# EAGLE schematic EEG_cap_v1 (EAGLE 9.6.2)

## Sheet 1 of 4
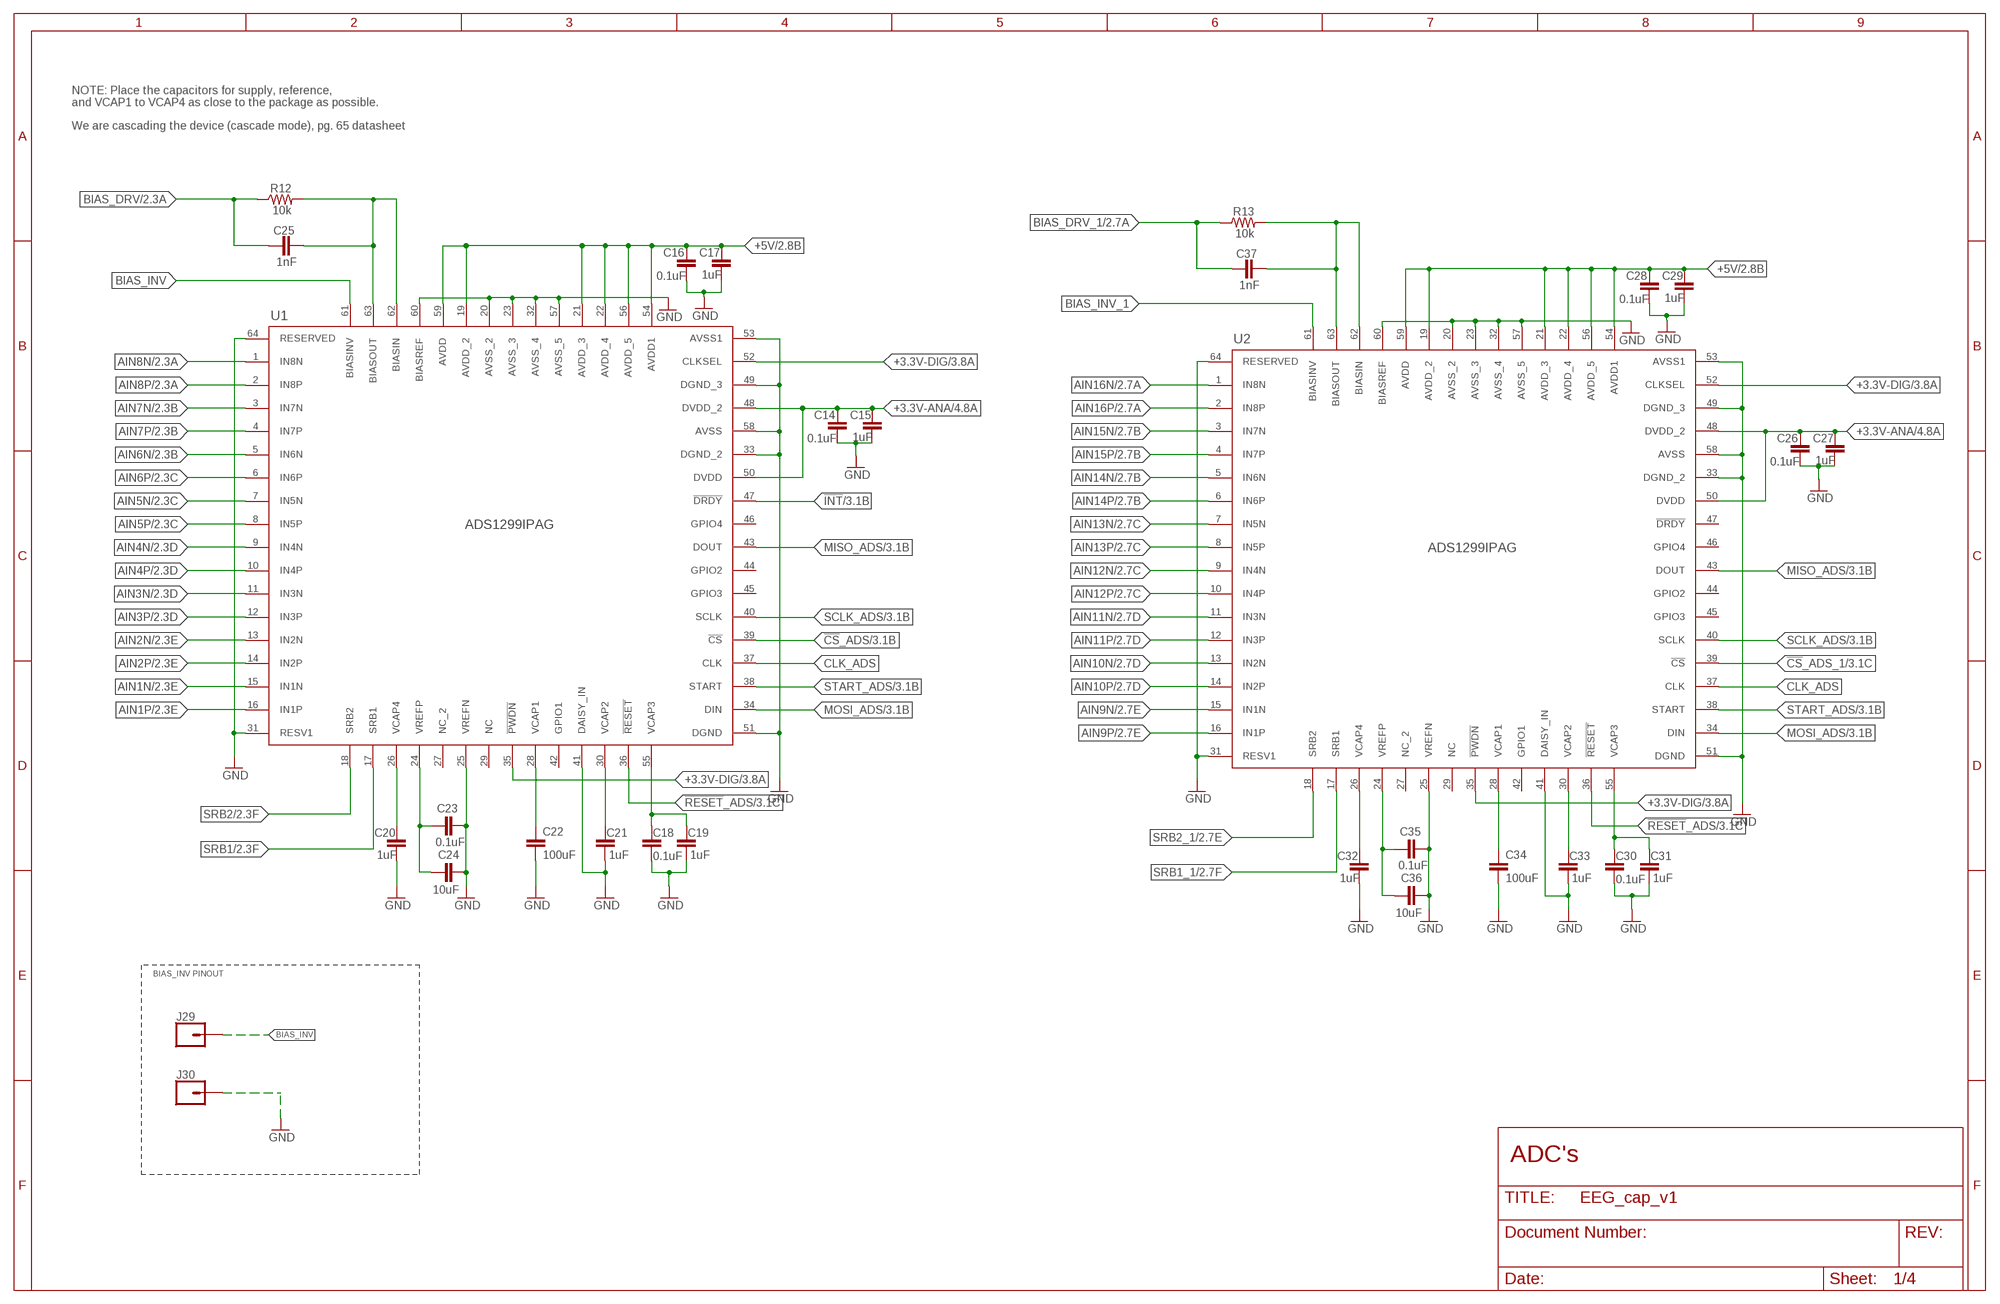
[diagram p0: schematic, sheet 1]

### Parts
C14  0.1uF  C-EUC0603  [C0603]
C15  1uF  C-EUC0603  [C0603]
C16  0.1uF  C-EUC0603  [C0603]
C17  1uF  C-EUC0603  [C0603]
C18  0.1uF  C-EUC0603  [C0603]
C19  1uF  C-EUC0603  [C0603]
C20  1uF  C-EUC0603  [C0603]
C21  1uF  C-EUC0603  [C0603]
C22  100uF  C-EUC1210  [C1210]
C23  0.1uF  C-EUC0603  [C0603]
C24  10uF  C-EUC0805  [C0805]
C25  1nF  C-EUC0603  [C0603]
C26  0.1uF  C-EUC0603  [C0603]
C27  1uF  C-EUC0603  [C0603]
C28  0.1uF  C-EUC0603  [C0603]
C29  1uF  C-EUC0603  [C0603]
C30  0.1uF  C-EUC0603  [C0603]
C31  1uF  C-EUC0603  [C0603]
C32  1uF  C-EUC0603  [C0603]
C33  1uF  C-EUC0603  [C0603]
C34  100uF  C-EUC1210  [C1210]
C35  0.1uF  C-EUC0603  [C0603]
C36  10uF  C-EUC0805  [C0805]
C37  1nF  C-EUC0603  [C0603]
J29  CONN_01  [1X01]
J30  CONN_01  [1X01]
R12  10k  R-US_R0805  [R0805]
R13  10k  R-US_R0805  [R0805]
U1  ADS1299IPAG  [PAG64_TEX]
U2  ADS1299IPAG  [PAG64_TEX]

### Nets
!CS!_ADS: U1.39(!CS) ; also sheet 3
!CS!_ADS_1: U2.39(!CS) ; also sheet 3
!INT!: U1.47(!DRDY) ; also sheet 3
!RESET!_ADS: U1.36(!RESET) U2.36(!RESET) ; also sheet 3
+3.3V-ANA: C14.1 C15.1 C26.1 C27.1 U1.48(DVDD_2) U1.50(DVDD) U2.48(DVDD_2) U2.50(DVDD) ; also sheet 4
+3.3V-DIG: U1.35(!PWDN) U1.52(CLKSEL) U2.35(!PWDN) U2.52(CLKSEL) ; also sheet 3,4
+5V: C16.1 C17.1 C28.1 C29.1 U1.19(AVDD_2) U1.21(AVDD_3) U1.22(AVDD_4) U1.54(AVDD1) U1.56(AVDD_5) U1.59(AVDD) U2.19(AVDD_2) U2.21(AVDD_3) U2.22(AVDD_4) U2.54(AVDD1) U2.56(AVDD_5) U2.59(AVDD) ; also sheet 2,3,4
AIN1N: U1.15(IN1N) ; also sheet 2
AIN1P: U1.16(IN1P) ; also sheet 2
AIN2N: U1.13(IN2N) ; also sheet 2
AIN2P: U1.14(IN2P) ; also sheet 2
AIN3N: U1.11(IN3N) ; also sheet 2
AIN3P: U1.12(IN3P) ; also sheet 2
AIN4N: U1.9(IN4N) ; also sheet 2
AIN4P: U1.10(IN4P) ; also sheet 2
AIN5N: U1.7(IN5N) ; also sheet 2
AIN5P: U1.8(IN5P) ; also sheet 2
AIN6N: U1.5(IN6N) ; also sheet 2
AIN6P: U1.6(IN6P) ; also sheet 2
AIN7N: U1.3(IN7N) ; also sheet 2
AIN7P: U1.4(IN7P) ; also sheet 2
AIN8N: U1.1(IN8N) ; also sheet 2
AIN8P: U1.2(IN8P) ; also sheet 2
AIN9N: U2.15(IN1N) ; also sheet 2
AIN9P: U2.16(IN1P) ; also sheet 2
AIN10N: U2.13(IN2N) ; also sheet 2
AIN10P: U2.14(IN2P) ; also sheet 2
AIN11N: U2.11(IN3N) ; also sheet 2
AIN11P: U2.12(IN3P) ; also sheet 2
AIN12N: U2.9(IN4N) ; also sheet 2
AIN12P: U2.10(IN4P) ; also sheet 2
AIN13N: U2.7(IN5N) ; also sheet 2
AIN13P: U2.8(IN5P) ; also sheet 2
AIN14N: U2.5(IN6N) ; also sheet 2
AIN14P: U2.6(IN6P) ; also sheet 2
AIN15N: U2.3(IN7N) ; also sheet 2
AIN15P: U2.4(IN7P) ; also sheet 2
AIN16N: U2.1(IN8N) ; also sheet 2
AIN16P: U2.2(IN8P) ; also sheet 2
BIAS: C25.2 R12.2 U1.62(BIASIN) U1.63(BIASOUT) ; also sheet 2
BIAS1: C37.2 R13.2 U2.62(BIASIN) U2.63(BIASOUT)
BIAS_DRV: C25.1 R12.1 ; also sheet 2
BIAS_DRV_1: C37.1 R13.1 ; also sheet 2
BIAS_INV: J29.1 U1.61(BIASINV)
BIAS_INV_1: U2.61(BIASINV)
CLK_ADS: U1.37(CLK) U2.37(CLK)
GND: C14.2 C15.2 C16.2 C17.2 C18.2 C19.2 C20.2 C21.2 C22.2 C23.2 C24.2 C26.2 C27.2 C28.2 C29.2 C30.2 C31.2 C32.2 C33.2 C34.2 C35.2 C36.2 J30.1 U1.20(AVSS_2) U1.23(AVSS_3) U1.25(VREFN) U1.31(RESV1) U1.32(AVSS_4) U1.33(DGND_2) U1.41(DAISY_IN) U1.49(DGND_3) U1.51(DGND) U1.53(AVSS1) U1.57(AVSS_5) U1.58(AVSS) U1.60(BIASREF) U1.64(RESERVED) U2.20(AVSS_2) U2.23(AVSS_3) U2.25(VREFN) U2.31(RESV1) U2.32(AVSS_4) U2.33(DGND_2) U2.41(DAISY_IN) U2.49(DGND_3) U2.51(DGND) U2.53(AVSS1) U2.57(AVSS_5) U2.58(AVSS) U2.60(BIASREF) U2.64(RESERVED) ; also sheet 2,3,4
MISO_ADS: U1.43(DOUT) U2.43(DOUT) ; also sheet 3
MOSI_ADS: U1.34(DIN) U2.34(DIN) ; also sheet 3
SCLK_ADS: U1.40(SCLK) U2.40(SCLK) ; also sheet 3
SRB1: U1.17(SRB1) ; also sheet 2
SRB1_1: U2.17(SRB1) ; also sheet 2
SRB2: U1.18(SRB2) ; also sheet 2
SRB2_1: U2.18(SRB2) ; also sheet 2
START_ADS: U1.38(START) U2.38(START) ; also sheet 3
VCAP1: C22.1 U1.28(VCAP1)
VCAP1_1: C34.1 U2.28(VCAP1)
VCAP2: C21.1 U1.30(VCAP2)
VCAP2_1: C33.1 U2.30(VCAP2)
VCAP3: C18.1 C19.1 U1.55(VCAP3)
VCAP3_1: C30.1 C31.1 U2.55(VCAP3)
VCAP4: C20.1 U1.26(VCAP4)
VCAP6: C32.1 U2.26(VCAP4)
VREFP: C23.1 C24.1 U1.24(VREFP)
VREFP_1: C35.1 C36.1 U2.24(VREFP)
Unconnected: U1.27(NC_2) U1.29(NC) U1.42(GPIO1) U1.44(GPIO2) U1.45(GPIO3) U1.46(GPIO4) U2.27(NC_2) U2.29(NC) U2.42(GPIO1) U2.44(GPIO2) U2.45(GPIO3) U2.46(GPIO4) U2.47(!DRDY)

### Notes on the sheet
- NOTE: Place the capacitors for supply, reference,
  and VCAP1 to VCAP4 as close to the package as possible.
- We are cascading the device (cascade mode), pg. 65 datasheet
- BIAS_INV PINOUT
- ADC's

## Sheet 2 of 4
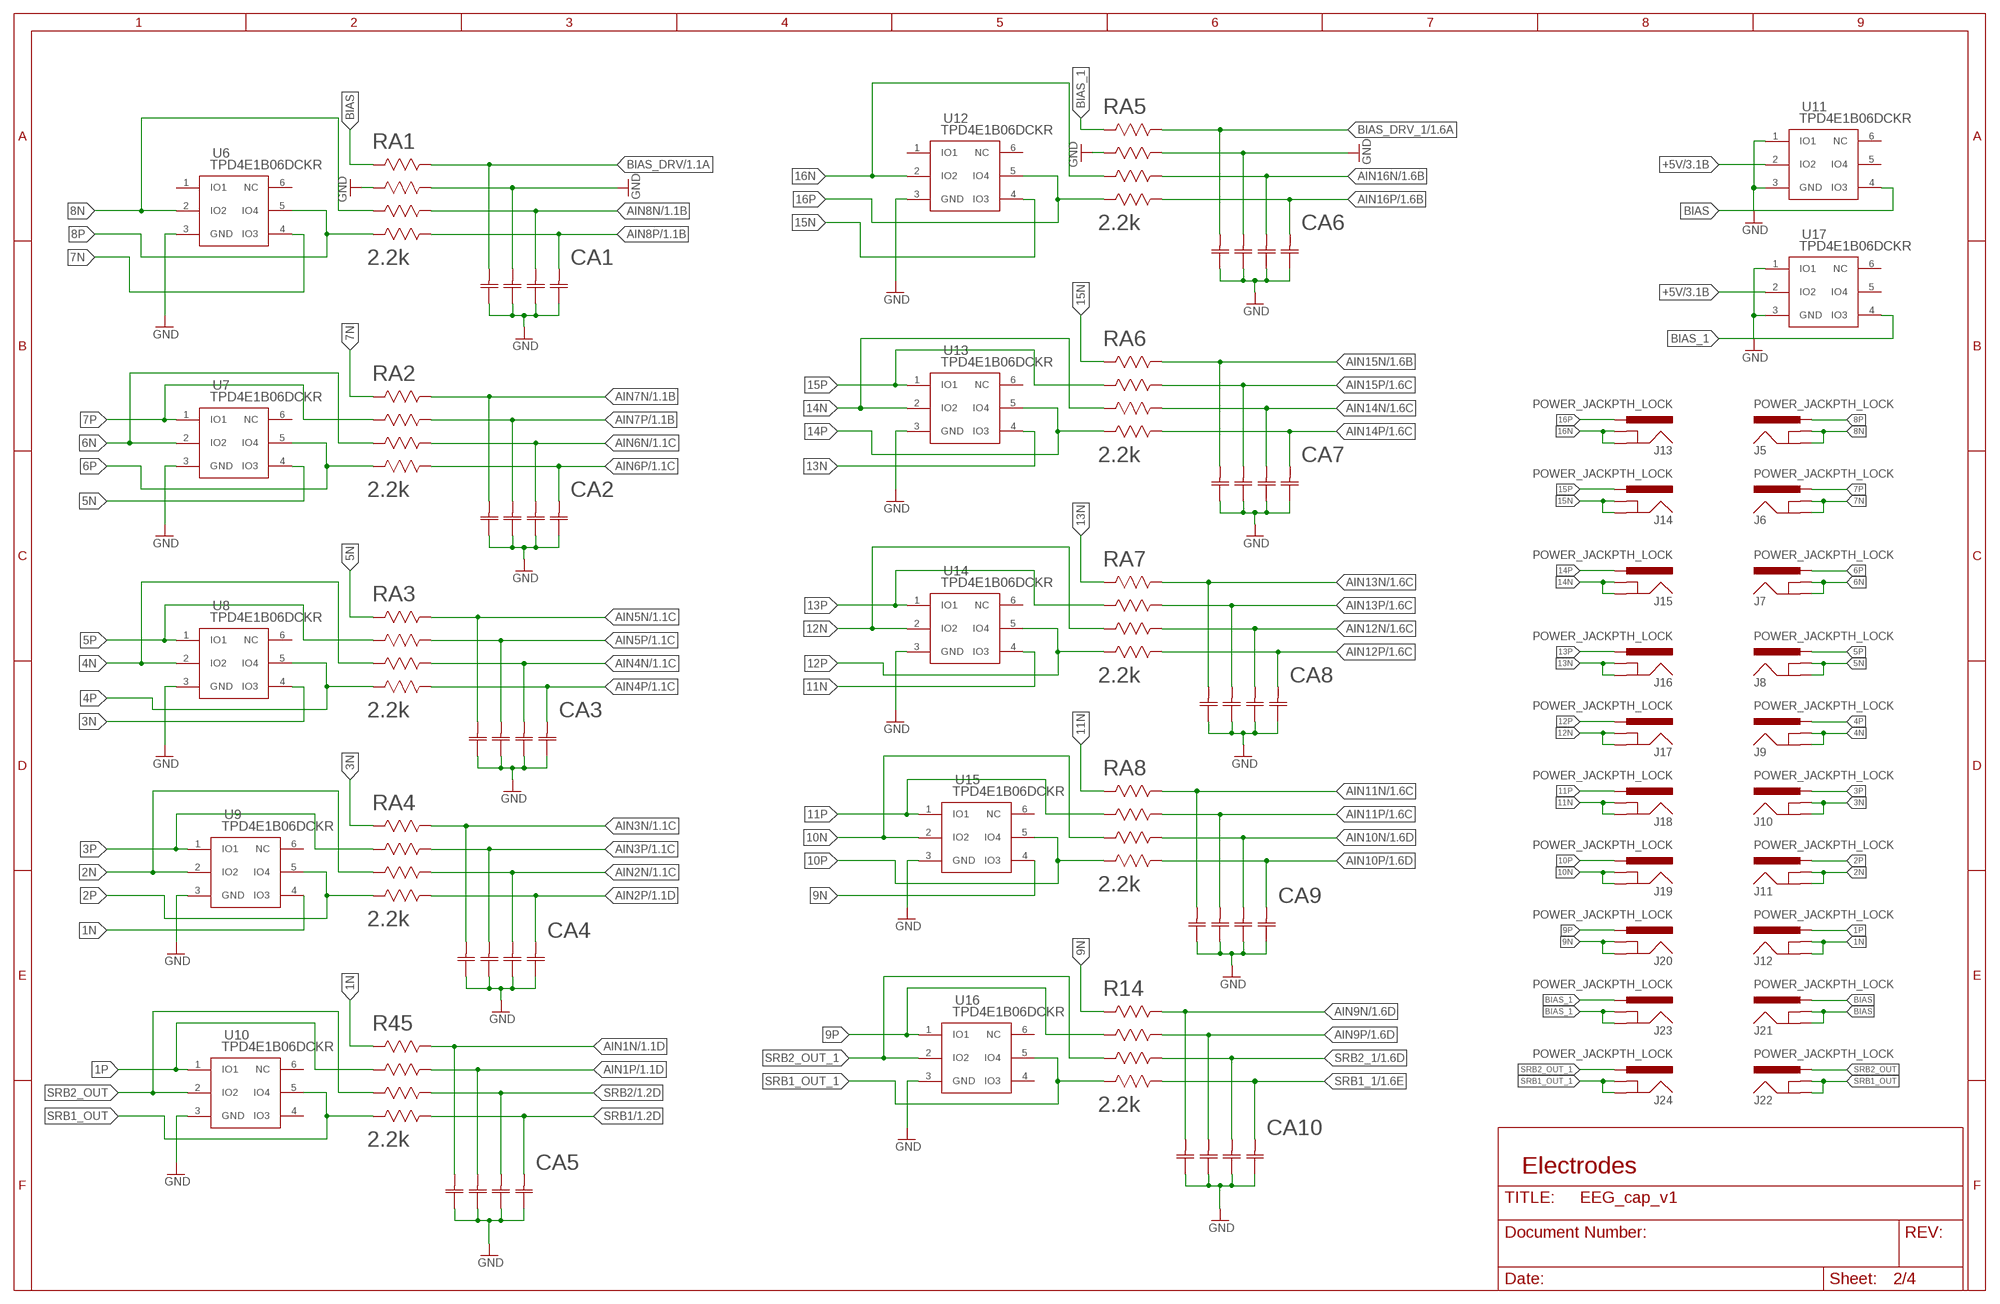
[diagram p1: schematic, sheet 2]

### Parts
CA1  CAP_ARRAY  [CAP_CA0612_3P2X1P6_YAG]
CA2  CAP_ARRAY  [CAP_CA0612_3P2X1P6_YAG]
CA3  CAP_ARRAY  [CAP_CA0612_3P2X1P6_YAG]
CA4  CAP_ARRAY  [CAP_CA0612_3P2X1P6_YAG]
CA5  CAP_ARRAY  [CAP_CA0612_3P2X1P6_YAG]
CA6  CAP_ARRAY  [CAP_CA0612_3P2X1P6_YAG]
CA7  CAP_ARRAY  [CAP_CA0612_3P2X1P6_YAG]
CA8  CAP_ARRAY  [CAP_CA0612_3P2X1P6_YAG]
CA9  CAP_ARRAY  [CAP_CA0612_3P2X1P6_YAG]
CA10  CAP_ARRAY  [CAP_CA0612_3P2X1P6_YAG]
J5  POWER_JACKPTH_LOCK  [POWER_JACK_PTH_LOCK]
J6  POWER_JACKPTH_LOCK  [POWER_JACK_PTH_LOCK]
J7  POWER_JACKPTH_LOCK  [POWER_JACK_PTH_LOCK]
J8  POWER_JACKPTH_LOCK  [POWER_JACK_PTH_LOCK]
J9  POWER_JACKPTH_LOCK  [POWER_JACK_PTH_LOCK]
J10  POWER_JACKPTH_LOCK  [POWER_JACK_PTH_LOCK]
J11  POWER_JACKPTH_LOCK  [POWER_JACK_PTH_LOCK]
J12  POWER_JACKPTH_LOCK  [POWER_JACK_PTH_LOCK]
J13  POWER_JACKPTH_LOCK  [POWER_JACK_PTH_LOCK]
J14  POWER_JACKPTH_LOCK  [POWER_JACK_PTH_LOCK]
J15  POWER_JACKPTH_LOCK  [POWER_JACK_PTH_LOCK]
J16  POWER_JACKPTH_LOCK  [POWER_JACK_PTH_LOCK]
J17  POWER_JACKPTH_LOCK  [POWER_JACK_PTH_LOCK]
J18  POWER_JACKPTH_LOCK  [POWER_JACK_PTH_LOCK]
J19  POWER_JACKPTH_LOCK  [POWER_JACK_PTH_LOCK]
J20  POWER_JACKPTH_LOCK  [POWER_JACK_PTH_LOCK]
J21  POWER_JACKPTH_LOCK  [POWER_JACK_PTH_LOCK]
J22  POWER_JACKPTH_LOCK  [POWER_JACK_PTH_LOCK]
J23  POWER_JACKPTH_LOCK  [POWER_JACK_PTH_LOCK]
J24  POWER_JACKPTH_LOCK  [POWER_JACK_PTH_LOCK]
R14  2.2k  CAT16-220J4LF  [BO_CAT16]
R45  2.2k  CAT16-220J4LF  [BO_CAT16]
RA1  2.2k  CAT16-220J4LF  [BO_CAT16]
RA2  2.2k  CAT16-220J4LF  [BO_CAT16]
RA3  2.2k  CAT16-220J4LF  [BO_CAT16]
RA4  2.2k  CAT16-220J4LF  [BO_CAT16]
RA5  2.2k  CAT16-220J4LF  [BO_CAT16]
RA6  2.2k  CAT16-220J4LF  [BO_CAT16]
RA7  2.2k  CAT16-220J4LF  [BO_CAT16]
RA8  2.2k  CAT16-220J4LF  [BO_CAT16]
U6  TPD4E1B06DCKR  [DCK6_TEX]
U7  TPD4E1B06DCKR  [DCK6_TEX]
U8  TPD4E1B06DCKR  [DCK6_TEX]
U9  TPD4E1B06DCKR  [DCK6_TEX]
U10  TPD4E1B06DCKR  [DCK6_TEX]
U11  TPD4E1B06DCKR  [DCK6_TEX]
U12  TPD4E1B06DCKR  [DCK6_TEX]
U13  TPD4E1B06DCKR  [DCK6_TEX]
U14  TPD4E1B06DCKR  [DCK6_TEX]
U15  TPD4E1B06DCKR  [DCK6_TEX]
U16  TPD4E1B06DCKR  [DCK6_TEX]
U17  TPD4E1B06DCKR  [DCK6_TEX]

### Nets
1N: J12.GND J12.GNDBREAK R45.1 U9.4(IO3)
1P: J12.PWR R45.2 U10.1(IO1)
2N: J11.GND J11.GNDBREAK RA4.3 U9.2(IO2)
2P: J11.PWR RA4.4 U9.5(IO4)
3N: J10.GND J10.GNDBREAK RA4.1 U8.4(IO3)
3P: J10.PWR RA4.2 U9.1(IO1)
4N: J9.GND J9.GNDBREAK RA3.3 U8.2(IO2)
4P: J9.PWR RA3.4 U8.5(IO4)
5N: J8.GND J8.GNDBREAK RA3.1 U7.4(IO3)
5P: J8.PWR RA3.2 U8.1(IO1)
6N: J7.GND J7.GNDBREAK RA2.3 U7.2(IO2)
6P: J7.PWR RA2.4 U7.5(IO4)
7N: J6.GND J6.GNDBREAK RA2.1 U6.4(IO3)
7P: J6.PWR RA2.2 U7.1(IO1)
8N: J5.GND J5.GNDBREAK RA1.3 U6.2(IO2)
8P: J5.PWR RA1.4 U6.5(IO4)
9N: J20.GND J20.GNDBREAK R14.1 U15.4(IO3)
9P: J20.PWR R14.2 U16.1(IO1)
10N: J19.GND J19.GNDBREAK RA8.3 U15.2(IO2)
10P: J19.PWR RA8.4 U15.5(IO4)
11N: J18.GND J18.GNDBREAK RA8.1 U14.4(IO3)
11P: J18.PWR RA8.2 U15.1(IO1)
12N: J17.GND J17.GNDBREAK RA7.3 U14.2(IO2)
12P: J17.PWR RA7.4 U14.5(IO4)
13N: J16.GND J16.GNDBREAK RA7.1 U13.4(IO3)
13P: J16.PWR RA7.2 U14.1(IO1)
14N: J15.GND J15.GNDBREAK RA6.3 U13.2(IO2)
14P: J15.PWR RA6.4 U13.5(IO4)
15N: J14.GND J14.GNDBREAK RA6.1 U12.4(IO3)
15P: J14.PWR RA6.2 U13.1(IO1)
16N: J13.GND J13.GNDBREAK RA5.3 U12.2(IO2)
16P: J13.PWR RA5.4 U12.5(IO4)
+5V: U11.2(IO2) U17.2(IO2) ; also sheet 1,3,4
AIN1N: CA5.8 R45.8 ; also sheet 1
AIN1P: CA5.7 R45.7 ; also sheet 1
AIN2N: CA4.6 RA4.6 ; also sheet 1
AIN2P: CA4.5 RA4.5 ; also sheet 1
AIN3N: CA4.8 RA4.8 ; also sheet 1
AIN3P: CA4.7 RA4.7 ; also sheet 1
AIN4N: CA3.6 RA3.6 ; also sheet 1
AIN4P: CA3.5 RA3.5 ; also sheet 1
AIN5N: CA3.8 RA3.8 ; also sheet 1
AIN5P: CA3.7 RA3.7 ; also sheet 1
AIN6N: CA2.6 RA2.6 ; also sheet 1
AIN6P: CA2.5 RA2.5 ; also sheet 1
AIN7N: CA2.8 RA2.8 ; also sheet 1
AIN7P: CA2.7 RA2.7 ; also sheet 1
AIN8N: CA1.6 RA1.6 ; also sheet 1
AIN8P: CA1.5 RA1.5 ; also sheet 1
AIN9N: CA10.8 R14.8 ; also sheet 1
AIN9P: CA10.7 R14.7 ; also sheet 1
AIN10N: CA9.6 RA8.6 ; also sheet 1
AIN10P: CA9.5 RA8.5 ; also sheet 1
AIN11N: CA9.8 RA8.8 ; also sheet 1
AIN11P: CA9.7 RA8.7 ; also sheet 1
AIN12N: CA8.6 RA7.6 ; also sheet 1
AIN12P: CA8.5 RA7.5 ; also sheet 1
AIN13N: CA8.8 RA7.8 ; also sheet 1
AIN13P: CA8.7 RA7.7 ; also sheet 1
AIN14N: CA7.6 RA6.6 ; also sheet 1
AIN14P: CA7.5 RA6.5 ; also sheet 1
AIN15N: CA7.8 RA6.8 ; also sheet 1
AIN15P: CA7.7 RA6.7 ; also sheet 1
AIN16N: CA6.6 RA5.6 ; also sheet 1
AIN16P: CA6.5 RA5.5 ; also sheet 1
BIAS: J21.GND J21.GNDBREAK J21.PWR RA1.1 U11.4(IO3) ; also sheet 1
BIAS_1: J23.GND J23.GNDBREAK J23.PWR RA5.1 U17.4(IO3)
BIAS_DRV: CA1.8 RA1.8 ; also sheet 1
BIAS_DRV_1: CA6.8 RA5.8 ; also sheet 1
GND: CA1.1 CA1.2 CA1.3 CA1.4 CA1.7 CA2.1 CA2.2 CA2.3 CA2.4 CA3.1 CA3.2 CA3.3 CA3.4 CA4.1 CA4.2 CA4.3 CA4.4 CA5.1 CA5.2 CA5.3 CA5.4 CA6.1 CA6.2 CA6.3 CA6.4 CA6.7 CA7.1 CA7.2 CA7.3 CA7.4 CA8.1 CA8.2 CA8.3 CA8.4 CA9.1 CA9.2 CA9.3 CA9.4 CA10.1 CA10.2 CA10.3 CA10.4 RA1.2 RA1.7 RA5.2 RA5.7 U6.3(GND) U7.3(GND) U8.3(GND) U9.3(GND) U10.3(GND) U11.1(IO1) U11.3(GND) U12.3(GND) U13.3(GND) U14.3(GND) U15.3(GND) U16.3(GND) U17.1(IO1) U17.3(GND) ; also sheet 1,3,4
SRB1: CA5.5 R45.5 ; also sheet 1
SRB1_1: CA10.5 R14.5 ; also sheet 1
SRB1_OUT: J22.GND J22.GNDBREAK R45.4 U10.5(IO4)
SRB1_OUT_1: J24.GND J24.GNDBREAK R14.4 U16.5(IO4)
SRB2: CA5.6 R45.6 ; also sheet 1
SRB2_1: CA10.6 R14.6 ; also sheet 1
SRB2_OUT: J22.PWR R45.3 U10.2(IO2)
SRB2_OUT_1: J24.PWR R14.3 U16.2(IO2)
Unconnected: U6.1(IO1) U6.6(NC) U7.6(NC) U8.6(NC) U9.6(NC) U10.4(IO3) U10.6(NC) U11.5(IO4) U11.6(NC) U12.1(IO1) U12.6(NC) U13.6(NC) U14.6(NC) U15.6(NC) U16.4(IO3) U16.6(NC) U17.5(IO4) U17.6(NC)

### Notes on the sheet
- Electrodes

## Sheet 3 of 4
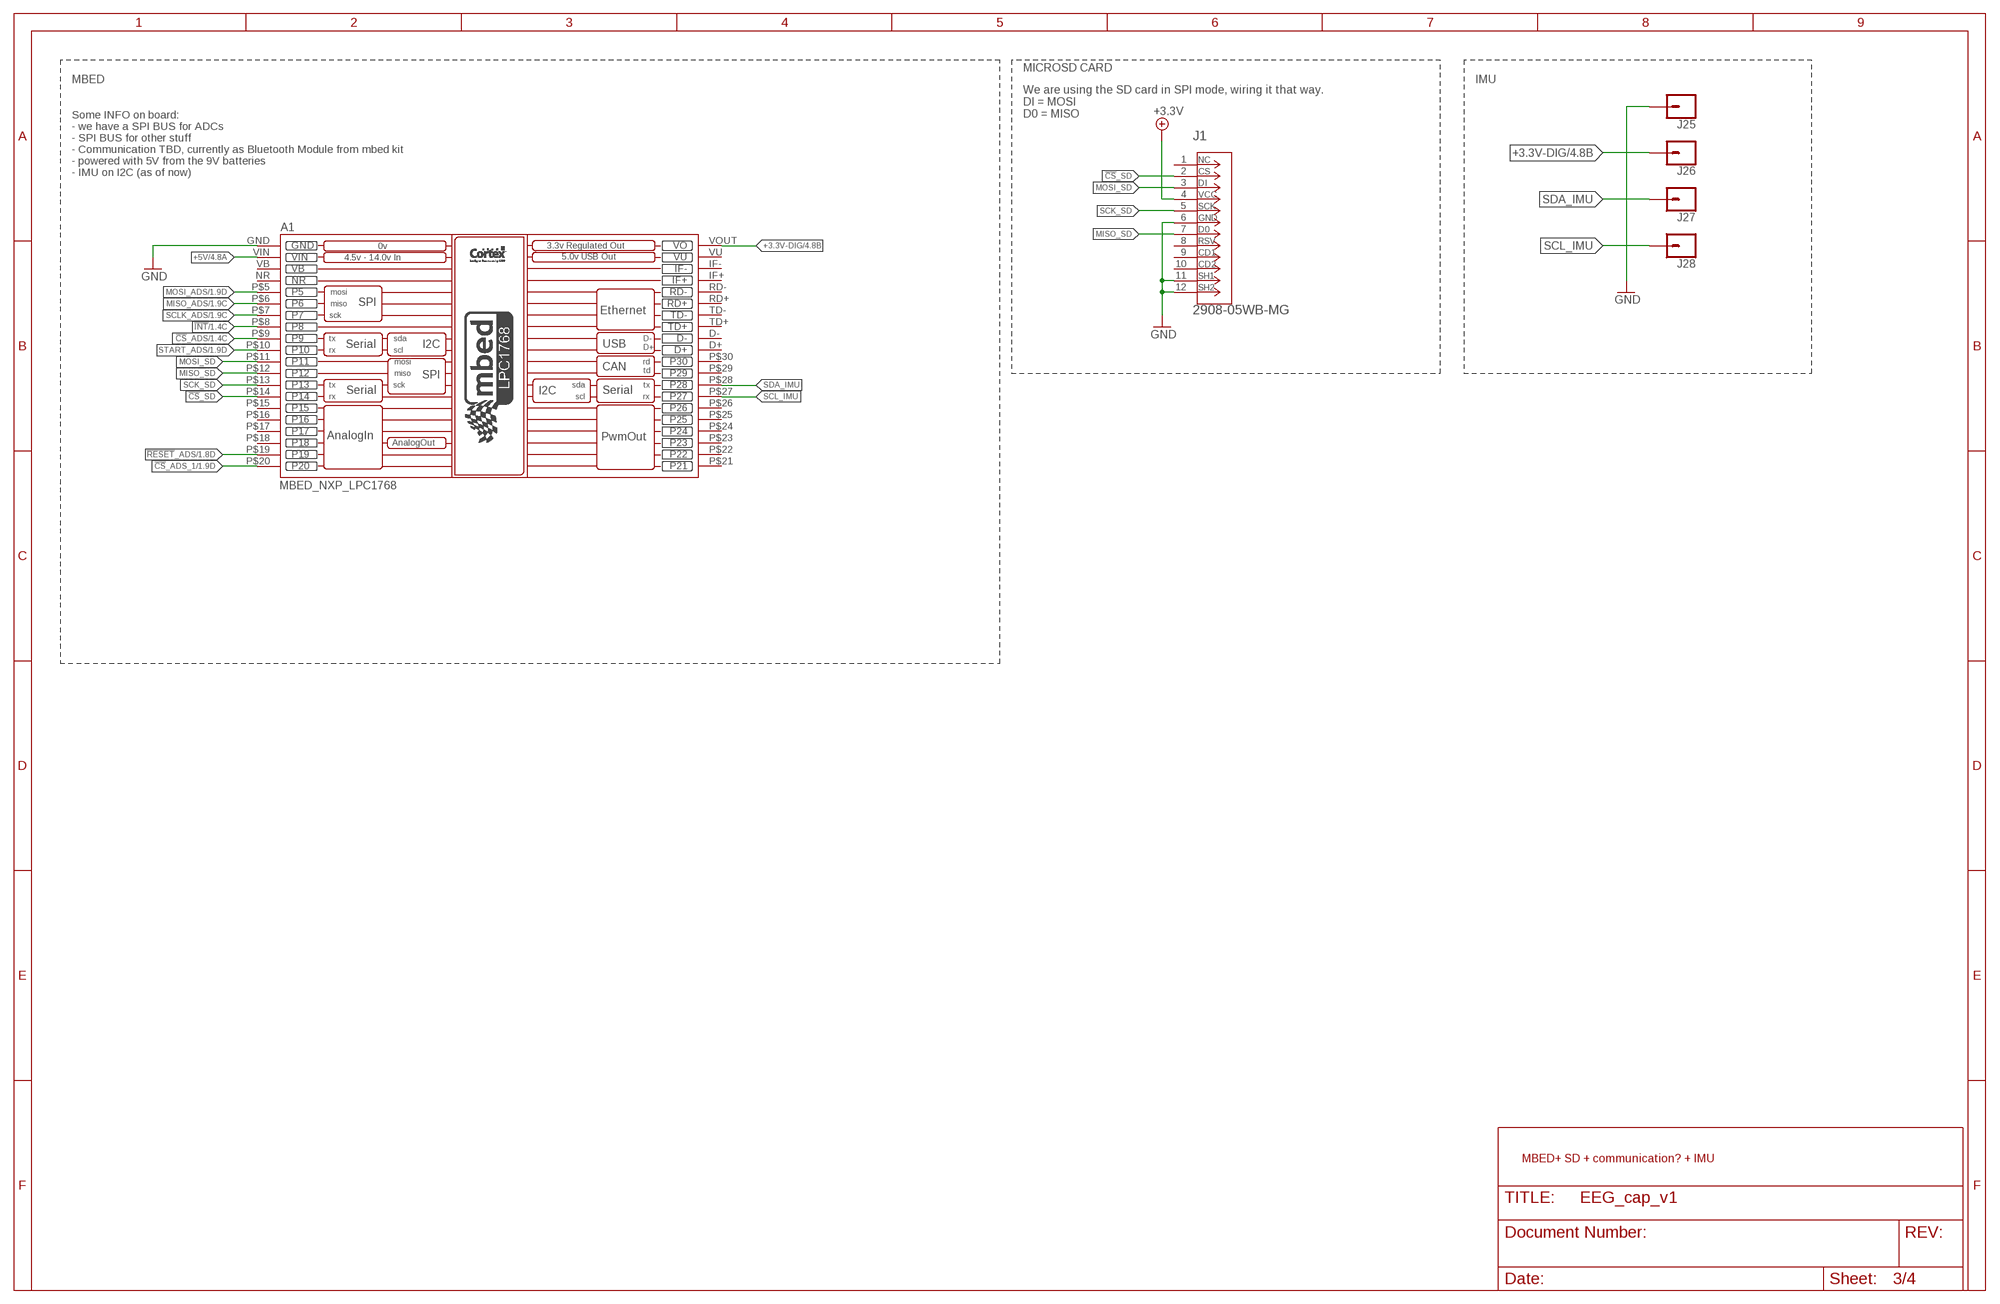
[diagram p2: schematic, sheet 3]

### Parts
A1  MBED_NXP_LPC1768  [MBED_LPC1768]
J1  2908-05WB-MG  [CONN_3M_2900]
J25  CONN_01  [1X01]
J26  CONN_01  [1X01]
J27  CONN_01  [1X01]
J28  CONN_01  [1X01]

### Nets
!CS!_ADS: A1.P$9(P9) ; also sheet 1
!CS!_ADS_1: A1.P$20(P20) ; also sheet 1
!CS!_SD: A1.P$14(P14) J1.2
!INT!: A1.P$8(P8) ; also sheet 1
!RESET!_ADS: A1.P$19(P19) ; also sheet 1
+3.3V: J1.4
+3.3V-DIG: A1.VOUT(VO) J26.1 ; also sheet 1,4
+5V: A1.VIN ; also sheet 1,2,4
GND: A1.GND J1.6 J1.11 J1.12 J25.1 ; also sheet 1,2,4
MISO_ADS: A1.P$6(P6) ; also sheet 1
MISO_SD: A1.P$12(P12) J1.7
MOSI_ADS: A1.P$5(P5) ; also sheet 1
MOSI_SD: A1.P$11(P11) J1.3
SCK_SD: A1.P$13(P13) J1.5
SCL_IMU: A1.P$27(P27) J28.1
SCLK_ADS: A1.P$7(P7) ; also sheet 1
SDA_IMU: A1.P$28(P28) J27.1
START_ADS: A1.P$10(P10) ; also sheet 1
Unconnected: A1.D+ A1.D- A1.IF+ A1.IF- A1.NR A1.P$15(P15) A1.P$16(P16) A1.P$17(P17) A1.P$18(P18) A1.P$21(P21) A1.P$22(P22) A1.P$23(P23) A1.P$24(P24) A1.P$25(P25) A1.P$26(P26) A1.P$29(P29) A1.P$30(P30) A1.RD+ A1.RD- A1.TD+ A1.TD- A1.VB A1.VU J1.1 J1.8 J1.9 J1.10

### Notes on the sheet
- MICROSD CARD
- MBED | IMU
- We are using the SD card in SPI mode, wiring it that way. 
  DI = MOSI
  D0 = MISO
- Some INFO on board: 
  - we have a SPI BUS for ADCs 
  - SPI BUS for other stuff 
  - Communication TBD, currently as Bluetooth Module from mbed kit 
  - powered with 5V from the 9V batteries 
  - IMU on I2C (as of now)
- MBED+ SD + communication? + IMU

## Sheet 4 of 4
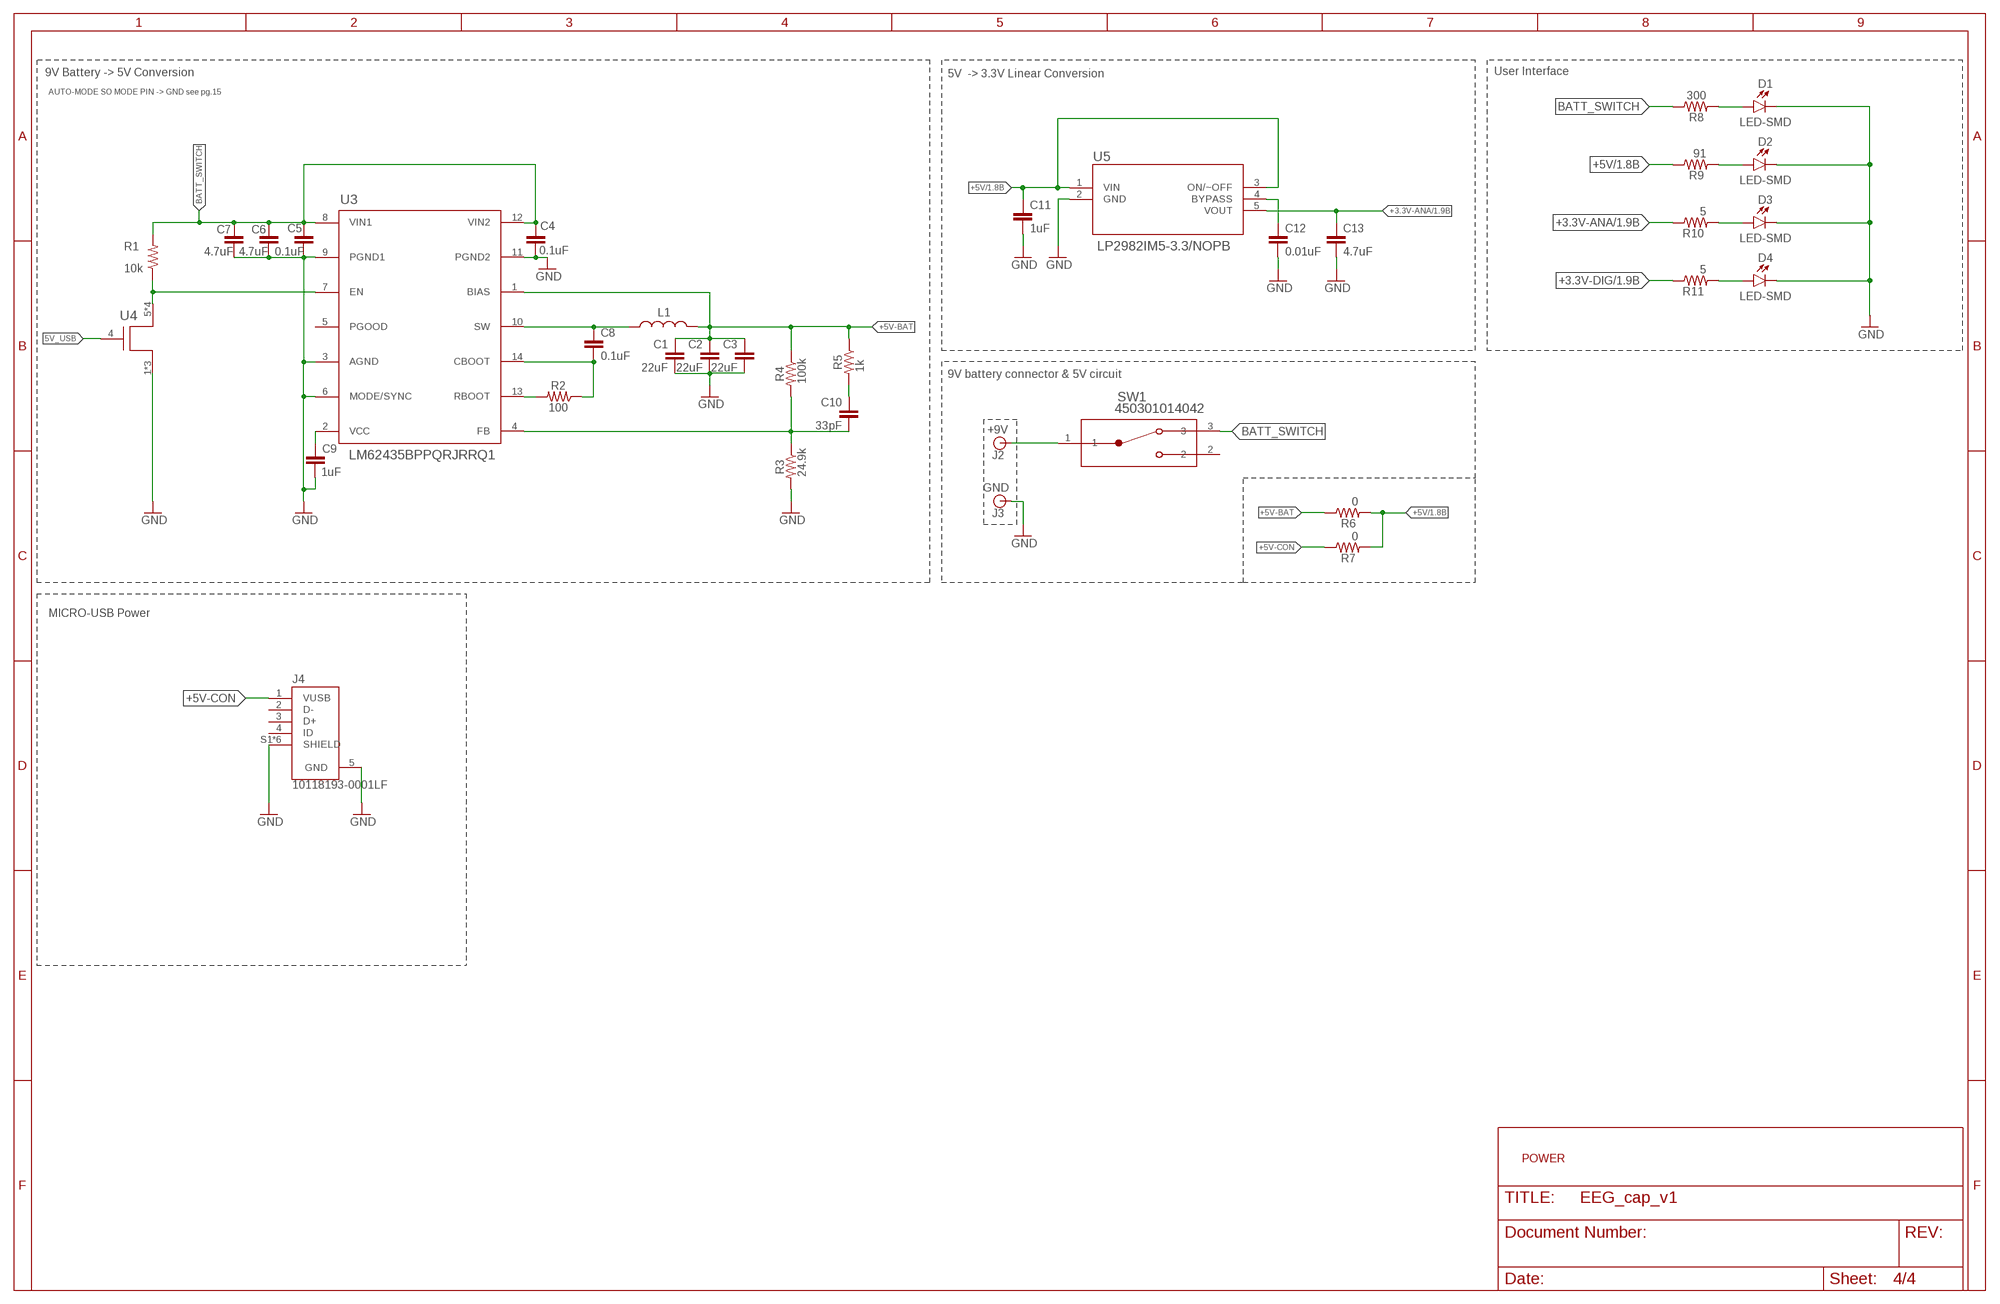
[diagram p3: schematic, sheet 4]

### Parts
C1  22uF  C-EUC0805  [C0805]
C2  22uF  C-EUC0805  [C0805]
C3  22uF  C-EUC0805  [C0805]
C4  0.1uF  C-EUC0805  [C0805]
C5  0.1uF  C-EUC0805  [C0805]
C6  4.7uF  C-EUC0805  [C0805]
C7  4.7uF  C-EUC0805  [C0805]
C8  0.1uF  C-EUC0805  [C0805]
C9  1uF  C-EUC0805  [C0805]
C10  33pF  C-EUC0805  [C0805]
C11  1uF  C-EUC0805  [C0805]
C12  0.01uF  C-EUC0805  [C0805]
C13  4.7uF  C-EUC0805  [C0805]
D1  LED-SMD  [LED0603]
D2  LED-SMD  [LED0603]
D3  LED-SMD  [LED0603]
D4  LED-SMD  [LED0603]
J2  +9V  BANANA_CONN  [BANANA_CONN]
J3  GND  BANANA_CONN  [BANANA_CONN]
J4  10118193-0001LF  [FCI_10118193-0001LF]
L1  DFE252010P-1R5M=P2  [INDC2520X100N]
R1  10k  R-US_R0805  [R0805]
R2  100  R-US_R0805  [R0805]
R3  24.9k  R-US_R0805  [R0805]
R4  100k  R-US_R0805  [R0805]
R5  1k  R-US_R0805  [R0805]
R6  0  R-US_R0805  [R0805]
R7  0  R-US_R0805  [R0805]
R8  300  R-US_R0805  [R0805]
R9  91  R-US_R0805  [R0805]
R10  5  R-US_R0805  [R0805]
R11  5  R-US_R0805  [R0805]
SW1  450301014042  [SW_450301014042_WRE]
U3  LM62435BPPQRJRRQ1  [VQFN-HR14_RJR_TEX]
U4  CSD17579Q5AT  [DQJ8_TEX]
U5  LP2982IM5-3.3/NOPB  [MF05A]

### Nets
3.3_ANA_LED: D3.A R10.2
3.3V_DIG_LED: D4.A R11.2
5V_LED: D2.A R9.2
5V_USB: U4.4(G)
9V_LED: D1.A R8.2
+3.3V-ANA: C13.1 R10.1 U5.5(VOUT) ; also sheet 1
+3.3V-DIG: R11.1 ; also sheet 1,3
+5V: C11.1 R6.2 R7.2 R9.1 U5.1(VIN) U5.3(ON/~OFF) ; also sheet 1,2,3
+5V-BAT: C1.1 C2.1 C3.1 L1.2 R4.1 R5.1 R6.1 U3.1(BIAS)
+5V-CON: J4.1(VUSB) R7.1
BATT: J2.P$1 SW1.1
BATT_SWITCH: C4.1 C5.1 C6.1 C7.1 R1.2 R8.1 SW1.3 U3.8(VIN1) U3.12(VIN2)
BYPASS: C12.1 U5.4(BYPASS)
CBOOT: C8.2 R2.1 U3.14(CBOOT)
EN: R1.1 U3.7(EN) U4.5(D) U4.6(D) U4.7(D) U4.8(D)
FB: C10.2 R3.1 R4.2 U3.4(FB)
FB_CAP: C10.1 R5.2
GND: C1.2 C2.2 C3.2 C4.2 C5.2 C6.2 C7.2 C9.2 C11.2 C12.2 C13.2 D1.C D2.C D3.C D4.C J3.P$1 J4.5(GND) J4.S1(SHIELD) J4.S2(SHIELD) J4.S3(SHIELD) J4.S4(SHIELD) J4.S5(SHIELD) J4.S6(SHIELD) R3.2 U3.3(AGND) U3.6(MODE/SYNC) U3.9(PGND1) U3.11(PGND2) U4.1(S) U4.2(S) U4.3(S) U5.2(GND) ; also sheet 1,2,3
RBOOT: R2.2 U3.13(RBOOT)
SW: C8.1 L1.1 U3.10(SW)
VCC_CHIP: C9.1 U3.2(VCC)
Unconnected: J4.2(D-) J4.3(D+) J4.4(ID) SW1.2 U3.5(PGOOD)

### Notes on the sheet
- 9V Battery -> 5V Conversion | 5V  -> 3.3V Linear Conversion | User Interface
- AUTO-MODE SO MODE PIN -> GND see pg.15
- 9V battery connector & 5V circuit
- MICRO-USB Power
- POWER

## Library data of the parts
A1 = RoboJackets-Boards:MBED_NXP_LPC1768: Mbed LPC1768 - ARM CORTEX v2.1 Website <https://os.mbed.com/platforms/mbed-LPC1768/>; DKPN: 568-4916-ND
C1-C37 = resistor:C-EU: CAPACITOR, European symbol
CA1-CA10 = ADC:CAP_ARRAY
D1-D4 = RoboJackets-LEDs:LED-SMD: Series of 0603 LEDs
J1 = ADC:2908-05WB-MG; COPYRIGHT: Copyright (C) 2021 Ultra Librarian. All rights reserved.; DIGI-KEY_PART_NUMBER_1: 3M5607TR-ND; DIGI-KEY_PART_NUMBER_2: 3M5607CT-ND; DIGI-KEY_PART_NUMBER_3: 3M5607DKR-ND; MANUFACTURER_PART_NUMBER: 2908-05WB-MG; MFR_NAME: 3M
J2 J3 = SparkFun-Connectors:BANANA_CONN: Through-hole Banana Jack Basic PTH connection for banana jack plugs SparkFun Products: Multimeter Kit <https://www.sparkfun.com/products/retired/10956> Banana to Alligator Cable <https://www.sparkfun.com/products/retired/509> Banana to Alligator Coax Cable <https://www.sparkfun.com/products/retired/508> Banana to Banana Cable <https://www.sparkfun.com/products/retired/507> Banana to IC Hook Cables <https://www.sparkfun.com/products/retired/506>
J4 = RoboJackets-Connectors:10118193-0001LF: Micro USB B Type Receptacle Datasheet <https://cdn.amphenol-icc.com/media/wysiwyg/files/documentation/datasheet/inputoutput/io_usb_micro.pdf>; DKPN: 609-4616-1-ND
J5-J24 = SparkFun-Connectors:POWER_JACK: Power Jack Connector This is the standard 5.5mm barrel jack for power. The PTH is the most common, proven, reliable, footprint. The Slot footprint only works if the mill layer is transmitted to the PCB fab house so be warned. Here are the connectors we sell at SparkFun: DC Barrel Power Jack/Connector <https://www.sparkfun.com/products/119> (PRT-00119) DC Barrel Power Jack/Connector (SMD) <https://www.sparkfun.com/products/12748> (PRT-12748) DC Barrel Jack Adapter - Breadboard Compatible <https://www.sparkfun.com/products/10811> (PRT-10811) It is used on this SparkFun product (and many, many others): SparkFun RedBoard - Programmed with Arduino <https://www.sparkfun.com/products/12757> (DEV-12757) Also, if you need a mating power supply or connector, please check these out: Wall Adapter Power Supply - 9VDC 650mA <https://www.sparkfun.com/products/298> (TOL-00298) DC Barrel Jack Adapter - Male <https://www.sparkfun.com/products/10287> (PRT-10287); PROD_ID: CONN-08197; SF_ID: PRT-00119
J25-J30 = SparkFun-Connectors:CONN_01: Single connection point. Often used as Generic Header-pin footprint for 0.1 inch spaced/style header connections On any of the 0.1 inch spaced packages, you can populate with these: Break Away Headers - Straight <https://www.sparkfun.com/products/116> (PRT-00116) Break Away Male Headers - Right Angle <https://www.sparkfun.com/products/553> (PRT-00553) Female Headers <https://www.sparkfun.com/products/115> (PRT-00115) Break Away Headers - Machine Pin <https://www.sparkfun.com/products/117> (PRT-00117) Break Away Female Headers - Swiss Machine Pin <https://www.sparkfun.com/products/743> (PRT-00743) This device is also useful as a general connection point to wire up your design to another part of your project. Our various solder wires solder well into these plated through hole pads. Hook-Up Wire - Assortment (Stranded, 22 AWG) <https://www.sparkfun.com/products/11375> (PRT-11375) Hook-Up Wire - Assortment (Solid Core, 22 AWG) <https://www.sparkfun.com/products/11367> (PRT-11367) View the entire wire category on our website here <https://www.sparkfun.com/categories/141> Special notes: SMTSO-256-ET is a "flush mount" nut for a 4-40 screw. We mostly use this on specialty testbeds; it is a nice way to connect hardware to your PCB at an adjustable hieght. Also note, the SNAP packages are for using a snappable style connector. We sell a baggie of snaps and they are also used on two LilyPad designs: Snap Assortment - 30 pack (male and female) <https://www.sparkfun.com/products/11347> (DEV-11347) LilyPad Arduino SimpleSnap <https://www.sparkfun.com/products/10941> (DEV-10941) LilyPad SimpleSnap Protoboard <https://www.sparkfun.com/products/10940> (DEV-10940)
L1 = ADC:DFE252010P-1R5M=P2: INDUCTOR, SHLD, 1.5UH, 20%, 2.5A, 1008; DESCRIPTION: Inductor with Inductance: 1.5uH Tol. +/-20%, Package: 1008 (2520); DIGI-KEY_PART_NUMBER: 490-10636-1-ND; MF: Murata; MP: DFE252010P-1R5M=P2; PACKAGE: 2520 Murata; PURCHASE-URL: https://pricing.snapeda.com/search/part/DFE252010P-1R5M=P2/?ref=eda
R1-R13 = resistor:R-US_: RESISTOR, American symbol
R14 R45 RA1-RA8 = ADC:CAT16-220J4LF; COPYRIGHT: Copyright (C) 2021 Ultra Librarian. All rights reserved.; MANUFACTURER_PART_NUMBER: CAT16-220J4LF; MFR_NAME: Bourns Electronics
SW1 = ADC:450301014042; COPYRIGHT: Copyright (C) 2021 Ultra Librarian. All rights reserved.; DIGI-KEY_PART_NUMBER_1: 450301014042-ND; MANUFACTURER_PART_NUMBER: 450301014042; MFR_NAME: Wurth Electronics
U1 U2 = ADC:ADS1299IPAG; COPYRIGHT: Copyright (C) 2021 Ultra Librarian. All rights reserved.; MANUFACTURER_PART_NUMBER: ADS1299IPAG; MFR_NAME: Texas Instruments
U3 = ADC:LM62435BPPQRJRRQ1; COPYRIGHT: Copyright (C) 2021 Ultra Librarian. All rights reserved.; DIGI-KEY_PART_NUMBER_1: 296-LM62435BPPQRJRRQ1TR-ND; MANUFACTURER_PART_NUMBER: LM62435BPPQRJRRQ1; MFR_NAME: Texas Instruments
U4 = ADC:CSD17579Q5AT; COPYRIGHT: Copyright (C) 2021 Ultra Librarian. All rights reserved.; DIGI-KEY_PART_NUMBER_1: 296-41100-1-ND; DIGI-KEY_PART_NUMBER_2: 296-41100-2-ND; DIGI-KEY_PART_NUMBER_3: 296-41100-6-ND; MANUFACTURER_PART_NUMBER: CSD17579Q5AT; MFR_NAME: Texas Instruments
U5 = ADC:LP2982IM5-3.3/NOPB; COPYRIGHT: Copyright (C) 2021 Ultra Librarian. All rights reserved.; DIGI-KEY_PART_NUMBER_1: 2156-LP2982IM5-3.3/NOPB-ND; DIGI-KEY_PART_NUMBER_2: 2156-LP2982IM5-3.3/NOPB-TI-ND; DIGI-KEY_PART_NUMBER_3: LP2982IM5-3.3/NOPBCT-ND; DIGI-KEY_PART_NUMBER_4: LP2982IM5-3.3/NOPBDKR-ND; DIGI-KEY_PART_NUMBER_5: LP2982IM5-3.3/NOPBTR-ND; MANUFACTURER_PART_NUMBER: LP2982IM5-3.3/NOPB; MFR_NAME: Texas Instruments; TYPE: LP2982AIM5-3.0
U6-U17 = ADC:TPD4E1B06DCKR; COPYRIGHT: Copyright (C) 2021 Ultra Librarian. All rights reserved.; DIGI-KEY_PART_NUMBER_1: 296-39346-1-ND; DIGI-KEY_PART_NUMBER_2: 296-39346-2-ND; DIGI-KEY_PART_NUMBER_3: 296-39346-6-ND; DIGI-KEY_PART_NUMBER_4: TPD4E1B06DCKR-ND; MANUFACTURER_PART_NUMBER: TPD4E1B06DCKR; MFR_NAME: Texas Instruments